# Altium schematic sheet PX1_Controle_ADC-LED.SchDoc
size 449 x 320 mm
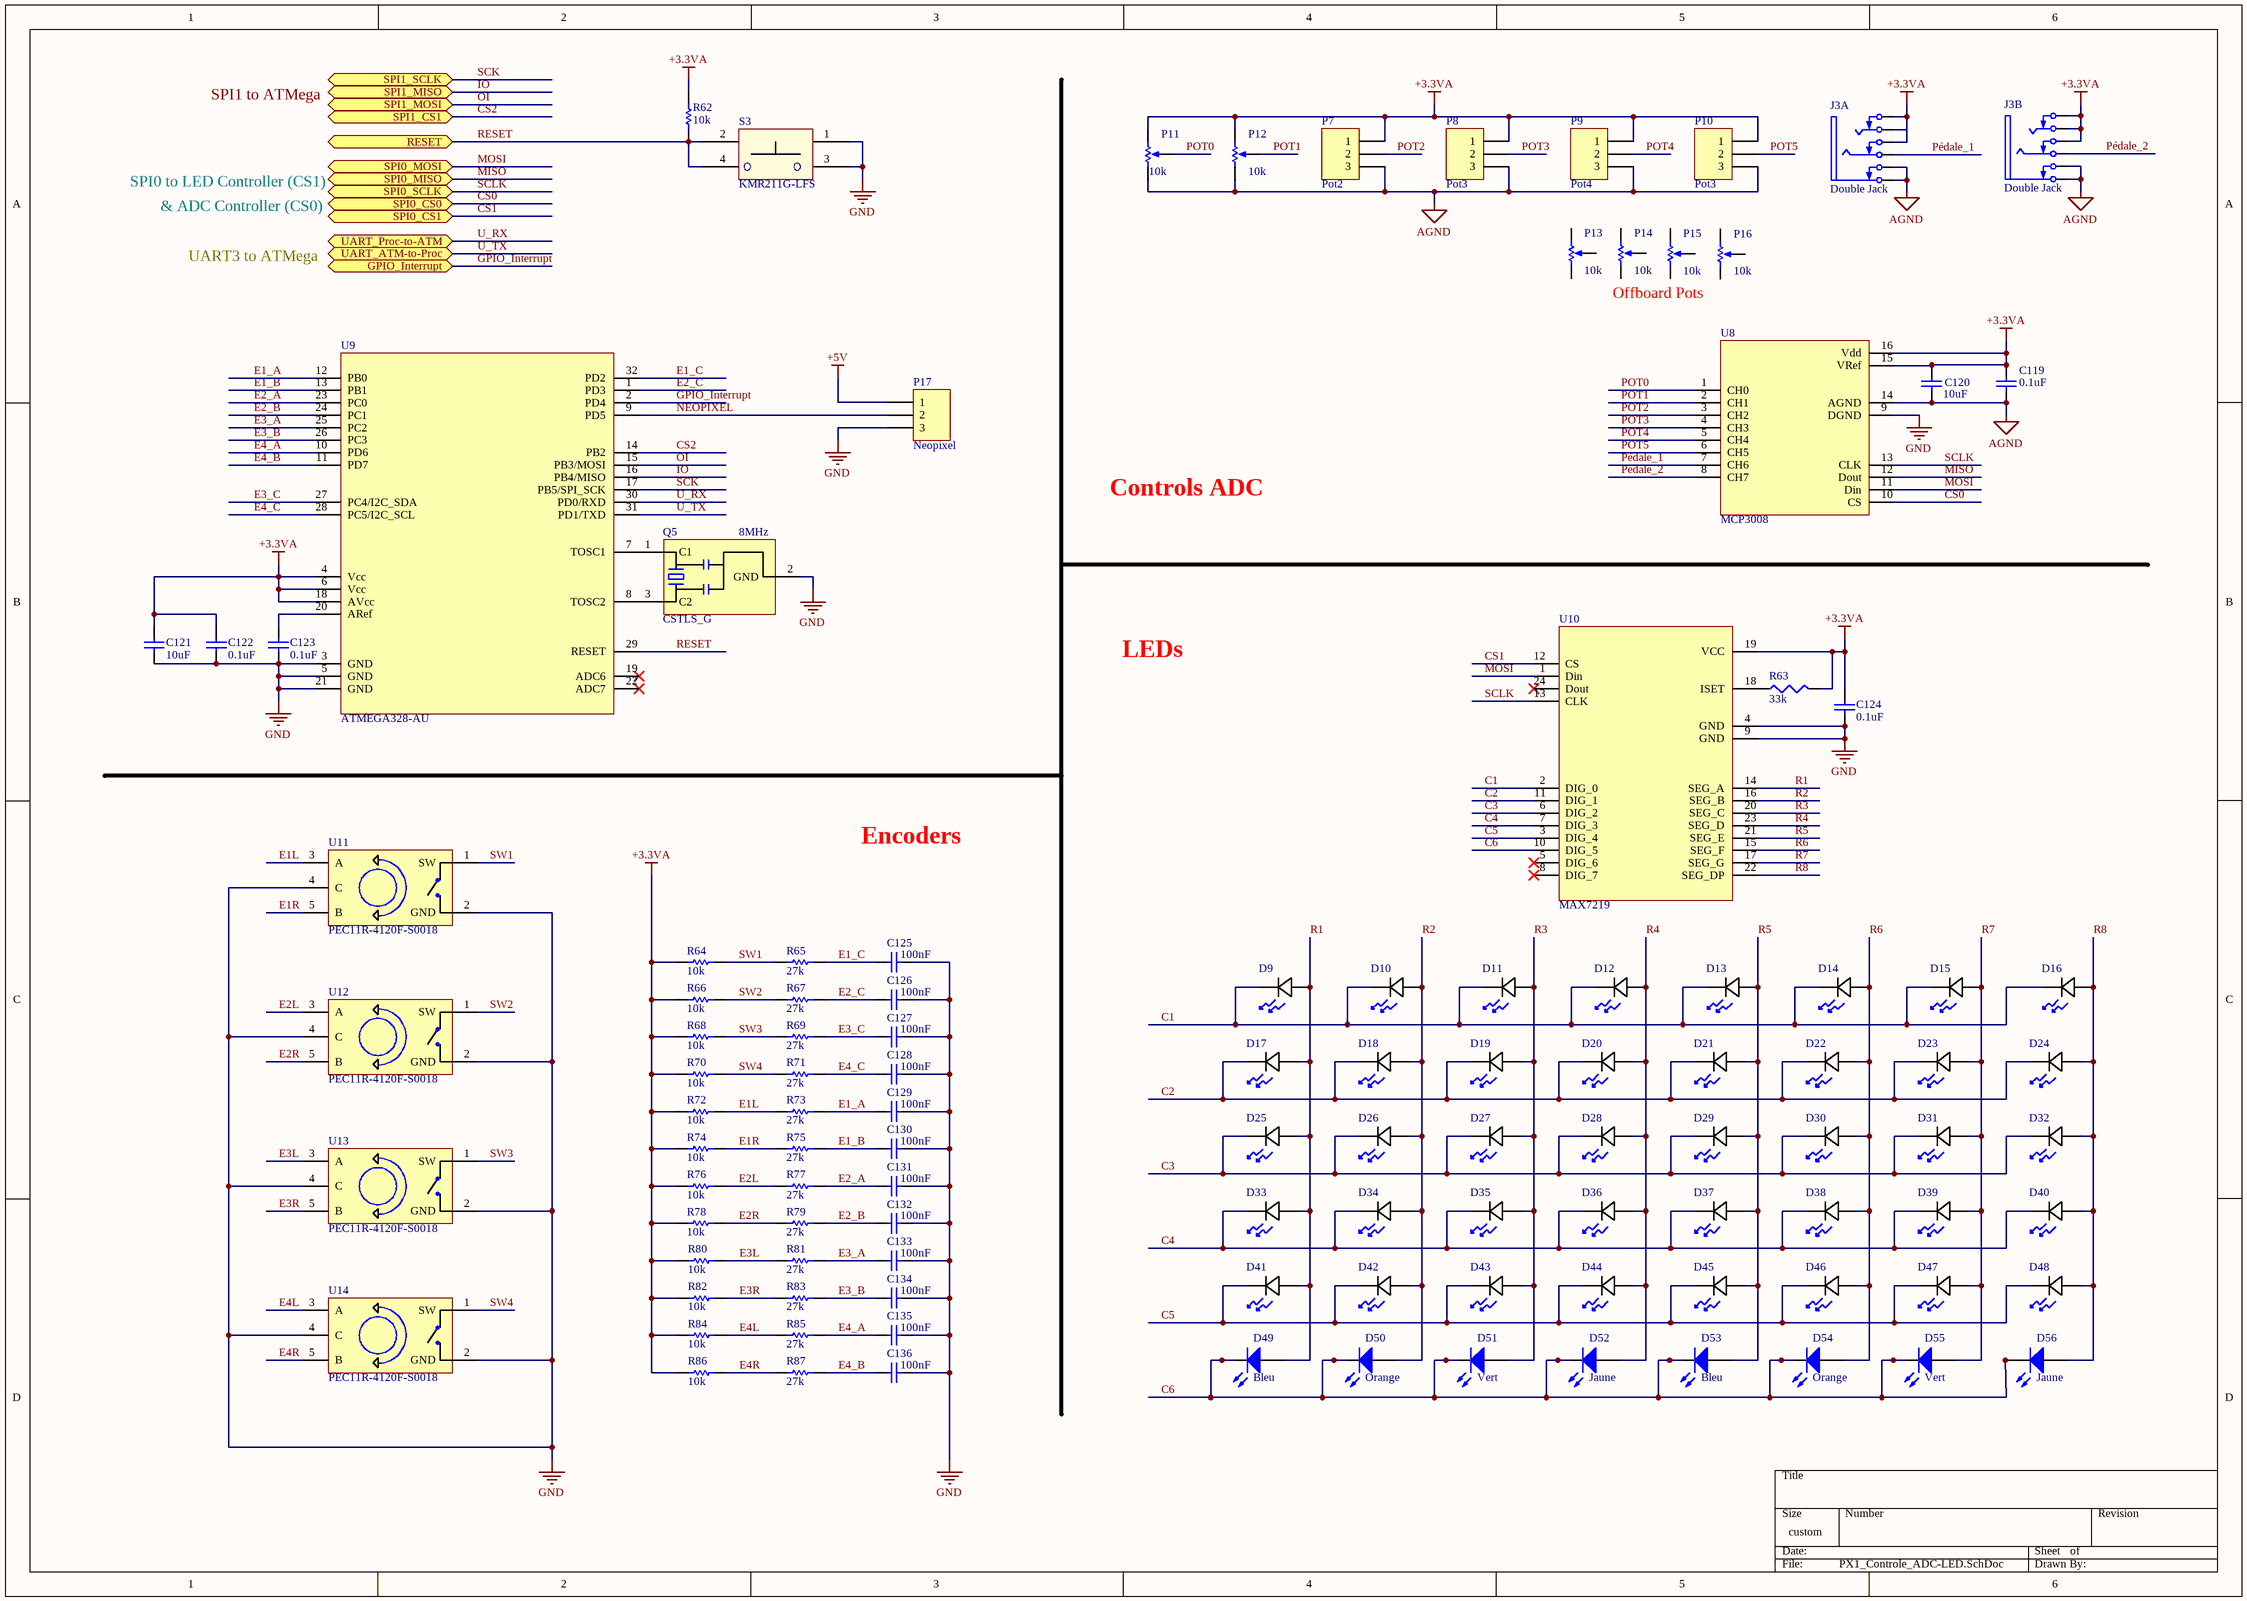
[diagram p0: PX1_Controle_ADC-LED.SchDoc]

## Parts
C119  0.1uF  [CAPC1608X08]
C120  10uF  [CAPC1608X08]
C121  value 10uF  [CAPC1608X08]  (hidden comment: Cap)
C122  value 0.1uF  [CAPC1608X08]  (hidden comment: Cap)
C123  value 0.1uF  [CAPC1608X08]  (hidden comment: Cap)
C124  value 0.1uF  [CAPC1608X08]  (hidden comment: Cap)
C125  value 100nF  [CAPC1608X08]  (hidden comment: Cap)
C126  value 100nF  [CAPC1608X08]  (hidden comment: Cap)
C127  value 100nF  [CAPC1608X08]  (hidden comment: Cap)
C128  value 100nF  [CAPC1608X08]  (hidden comment: Cap)
C129  value 100nF  [CAPC1608X08]  (hidden comment: Cap)
C130  value 100nF  [CAPC1608X08]  (hidden comment: Cap)
C131  value 100nF  [CAPC1608X08]  (hidden comment: Cap)
C132  value 100nF  [CAPC1608X08]  (hidden comment: Cap)
C133  value 100nF  [CAPC1608X08]  (hidden comment: Cap)
C134  value 100nF  [CAPC1608X08]  (hidden comment: Cap)
C135  value 100nF  [CAPC1608X08]  (hidden comment: Cap)
C136  value 100nF  [CAPC1608X08]  (hidden comment: Cap)
D9  LNJ937W8CRA  [LED_LNJ]  (value not drawn)
D10  LNJ937W8CRA  [LED_LNJ]  (value not drawn)
D11  LNJ937W8CRA  [LED_LNJ]  (value not drawn)
D12  LNJ937W8CRA  [LED_LNJ]  (value not drawn)
D13  LNJ937W8CRA  [LED_LNJ]  (value not drawn)
D14  LNJ937W8CRA  [LED_LNJ]  (value not drawn)
D15  LNJ937W8CRA  [LED_LNJ]  (value not drawn)
D16  LNJ937W8CRA  [LED_LNJ]  (value not drawn)
D17  LNJ937W8CRA  [LED_LNJ]  (value not drawn)
D18  LNJ937W8CRA  [LED_LNJ]  (value not drawn)
D19  LNJ937W8CRA  [LED_LNJ]  (value not drawn)
D20  LNJ937W8CRA  [LED_LNJ]  (value not drawn)
D21  LNJ937W8CRA  [LED_LNJ]  (value not drawn)
D22  LNJ937W8CRA  [LED_LNJ]  (value not drawn)
D23  LNJ937W8CRA  [LED_LNJ]  (value not drawn)
D24  LNJ937W8CRA  [LED_LNJ]  (value not drawn)
D25  LNJ937W8CRA  [LED_LNJ]  (value not drawn)
D26  LNJ937W8CRA  [LED_LNJ]  (value not drawn)
D27  LNJ937W8CRA  [LED_LNJ]  (value not drawn)
D28  LNJ937W8CRA  [LED_LNJ]  (value not drawn)
D29  LNJ937W8CRA  [LED_LNJ]  (value not drawn)
D30  LNJ937W8CRA  [LED_LNJ]  (value not drawn)
D31  LNJ937W8CRA  [LED_LNJ]  (value not drawn)
D32  LNJ937W8CRA  [LED_LNJ]  (value not drawn)
D33  LNJ937W8CRA  [LED_LNJ]  (value not drawn)
D34  LNJ937W8CRA  [LED_LNJ]  (value not drawn)
D35  LNJ937W8CRA  [LED_LNJ]  (value not drawn)
D36  LNJ937W8CRA  [LED_LNJ]  (value not drawn)
D37  LNJ937W8CRA  [LED_LNJ]  (value not drawn)
D38  LNJ937W8CRA  [LED_LNJ]  (value not drawn)
D39  LNJ937W8CRA  [LED_LNJ]  (value not drawn)
D40  LNJ937W8CRA  [LED_LNJ]  (value not drawn)
D41  LNJ937W8CRA  [LED_LNJ]  (value not drawn)
D42  LNJ937W8CRA  [LED_LNJ]  (value not drawn)
D43  LNJ937W8CRA  [LED_LNJ]  (value not drawn)
D44  LNJ937W8CRA  [LED_LNJ]  (value not drawn)
D45  LNJ937W8CRA  [LED_LNJ]  (value not drawn)
D46  LNJ937W8CRA  [LED_LNJ]  (value not drawn)
D47  LNJ937W8CRA  [LED_LNJ]  (value not drawn)
D48  LNJ937W8CRA  [LED_LNJ]  (value not drawn)
D49  Bleu  [LED_LNJ]
D50  Orange  [LED_LNJ]
D51  Vert  [LED_LNJ]
D52  Jaune  [LED_LNJ]
D53  Bleu  [LED_LNJ]
D54  Orange  [LED_LNJ]
D55  Vert  [LED_LNJ]
D56  Jaune  [LED_LNJ]
J3  Double Jack  [Amphenol_ACJS-MHDC]  (parts A,B of 2)
P7  Pot2  [CONN_1241150-3_T]
P8  Pot3  [CONN_1241150-3_T]
P9  Pot4  [CONN_1241150-3_T]
P10  Pot3  [CONN_1241150-3_T]
P11  value 10k  [ALPS_RK09K1130C79]  (hidden comment: RPot)
P12  value 10k  [ALPS_RK09K1130C79]  (hidden comment: RPot)
P13  value 10k  (hidden comment: RPot)
P14  value 10k  (hidden comment: RPot)
P15  value 10k  (hidden comment: RPot)
P16  value 10k  (hidden comment: RPot)
P17  Neopixel  [CONN_1241150-3_T]
Q5  CSTLS_G  value 8MHz  [CSTCC_G]
R62  value 10k  [RESC1608X05]  (hidden comment: Res1)
R63  33k  [RESC1608X05]
R64  value 10k  [RESC1608X05]  (hidden comment: Res1)
R65  value 27k  [RESC1608X05]  (hidden comment: Res1)
R66  value 10k  [RESC1608X05]  (hidden comment: Res1)
R67  value 27k  [RESC1608X05]  (hidden comment: Res1)
R68  value 10k  [RESC1608X05]  (hidden comment: Res1)
R69  value 27k  [RESC1608X05]  (hidden comment: Res1)
R70  value 10k  [RESC1608X05]  (hidden comment: Res1)
R71  value 27k  [RESC1608X05]  (hidden comment: Res1)
R72  value 10k  [RESC1608X05]  (hidden comment: Res1)
R73  value 27k  [RESC1608X05]  (hidden comment: Res1)
R74  value 10k  [RESC1608X05]  (hidden comment: Res1)
R75  value 27k  [RESC1608X05]  (hidden comment: Res1)
R76  value 10k  [RESC1608X05]  (hidden comment: Res1)
R77  value 27k  [RESC1608X05]  (hidden comment: Res1)
R78  value 10k  [RESC1608X05]  (hidden comment: Res1)
R79  value 27k  [RESC1608X05]  (hidden comment: Res1)
R80  value 10k  [RESC1608X05]  (hidden comment: Res1)
R81  value 27k  [RESC1608X05]  (hidden comment: Res1)
R82  value 10k  [RESC1608X05]  (hidden comment: Res1)
R83  value 27k  [RESC1608X05]  (hidden comment: Res1)
R84  value 10k  [RESC1608X05]  (hidden comment: Res1)
R85  value 27k  [RESC1608X05]  (hidden comment: Res1)
R86  value 10k  [RESC1608X05]  (hidden comment: Res1)
R87  value 27k  [RESC1608X05]  (hidden comment: Res1)
S3  KMR211G-LFS  [C&K_KMR211G]
U8  MCP3008  [SOIC16_MCP3008]
U9  ATMEGA328-AU  [32A-M]
U10  MAX7219  [21-0042B_24-M]
U11  PEC11R-4120F-S0018  [BOURNS_PEC11R-4120F-S0018]
U12  PEC11R-4120F-S0018  [BOURNS_PEC11R-4120F-S0018]
U13  PEC11R-4120F-S0018  [BOURNS_PEC11R-4120F-S0018]
U14  PEC11R-4120F-S0018  [BOURNS_PEC11R-4120F-S0018]

## Ports
GPIO_Interrupt, RESET, SPI0_CS0, SPI0_CS1, SPI0_MISO, SPI0_MOSI, SPI0_SCLK, SPI1_CS1, SPI1_MISO, SPI1_MOSI, SPI1_SCLK, UART_ATM-to-Proc, UART_Proc-to-ATM

## Nets
+3.3VA: C119.1 C120.1 C121.1 C122.1 C124.1 J3.2(RB) J3.3(TB) J3.6(T) J3.8(RB) J3.9(TB) J3.12(T) P7.1 P8.1 P9.1 P10.1 P11.2(BOT) P12.2(BOT) R62.1 R63.2 R64.1 R66.1 R68.1 R70.1 R72.1 R74.1 R76.1 R78.1 R80.1 R82.1 R84.1 R86.1 U8.15(VRef) U8.16(Vdd) U9.4(Vcc) U9.6(Vcc) U9.18(AVcc) U10.19(VCC)
+5V: P17.1
AGND: C119.2 C120.2 J3.1(SB) J3.4(S) J3.7(SB) J3.10(S) P7.3 P8.3 P9.3 P10.3 P11.1(TOP) P12.1(TOP) U8.14(AGND)
GND: C121.2 C122.2 C123.2 C124.2 C125.1 C126.1 C127.1 C128.1 C129.1 C130.1 C131.1 C132.1 C133.1 C134.1 C135.1 C136.1 P17.3 Q5.2(GND) S3.1 S3.3 U8.9(DGND) U9.3(GND) U9.5(GND) U9.21(GND) U10.4(GND) U10.9(GND) U11.2(GND) U11.4(C) U12.2(GND) U12.4(C) U13.2(GND) U13.4(C) U14.2(GND) U14.4(C)
C1: D9.1 D10.1 D11.1 D12.1 D13.1 D14.1 D15.1 D16.1 U10.2(DIG_0)
C2: D17.1 D18.1 D19.1 D20.1 D21.1 D22.1 D23.1 D24.1 U10.11(DIG_1)
C3: D25.1 D26.1 D27.1 D28.1 D29.1 D30.1 D31.1 D32.1 U10.6(DIG_2)
C4: D33.1 D34.1 D35.1 D36.1 D37.1 D38.1 D39.1 D40.1 U10.7(DIG_3)
C5: D41.1 D42.1 D43.1 D44.1 D45.1 D46.1 D47.1 D48.1 U10.3(DIG_4)
C6: D49.2(K) D50.2(K) D51.2(K) D52.2(K) D53.2(K) D54.2(K) D55.2(K) D56.2(K) U10.10(DIG_5)
CS0: U8.10(CS) ; port SPI0_CS0
CS1: U10.12(CS) ; port SPI0_CS1
CS2: U9.14(PB2) ; port SPI1_CS1
E1_A: C129.2 R73.2 U9.12(PB0)
E1_B: C130.2 R75.2 U9.13(PB1)
E1_C: C125.2 R65.2 U9.32(PD2)
E1L: R72.2 R73.1 U11.3(A)
E1R: R74.2 R75.1 U11.5(B)
E2_A: C131.2 R77.2 U9.23(PC0)
E2_B: C132.2 R79.2 U9.24(PC1)
E2_C: C126.2 R67.2 U9.1(PD3)
E2L: R76.2 R77.1 U12.3(A)
E2R: R78.2 R79.1 U12.5(B)
E3_A: C133.2 R81.2 U9.25(PC2)
E3_B: C134.2 R83.2 U9.26(PC3)
E3_C: C127.2 R69.2 U9.27(PC4/I2C_SDA)
E3L: R80.2 R81.1 U13.3(A)
E3R: R82.2 R83.1 U13.5(B)
E4_A: C135.2 R85.2 U9.10(PD6)
E4_B: C136.2 R87.2 U9.11(PD7)
E4_C: C128.2 R71.2 U9.28(PC5/I2C_SCL)
E4L: R84.2 R85.1 U14.3(A)
E4R: R86.2 R87.1 U14.5(B)
GPIO_Interrupt: U9.2(PD4) ; port GPIO_Interrupt
IO: U9.16(PB4/MISO) ; port SPI1_MISO
MISO: U8.12(Dout) ; port SPI0_MISO
MOSI: U8.11(Din) U10.1(Din) ; port SPI0_MOSI
NEOPIXEL: P17.2 U9.9(PD5)
OI: U9.15(PB3/MOSI) ; port SPI1_MOSI
POT0: P11.3(TAP) U8.1(CH0)
POT1: P12.3(TAP) U8.2(CH1)
POT2: P7.2 U8.3(CH2)
POT3: P8.2 U8.4(CH3)
POT4: P9.2 U8.5(CH4)
POT5: P10.2 U8.6(CH5)
Pédale_1: J3.11(R) U8.7(CH6)
Pédale_2: J3.5(R) U8.8(CH7)
R1: D9.2 D17.2 D25.2 D33.2 D41.2 D49.1(A) U10.14(SEG_A)
R2: D10.2 D18.2 D26.2 D34.2 D42.2 D50.1(A) U10.16(SEG_B)
R3: D11.2 D19.2 D27.2 D35.2 D43.2 D51.1(A) U10.20(SEG_C)
R4: D12.2 D20.2 D28.2 D36.2 D44.2 D52.1(A) U10.23(SEG_D)
R5: D13.2 D21.2 D29.2 D37.2 D45.2 D53.1(A) U10.21(SEG_E)
R6: D14.2 D22.2 D30.2 D38.2 D46.2 D54.1(A) U10.15(SEG_F)
R7: D15.2 D23.2 D31.2 D39.2 D47.2 D55.1(A) U10.17(SEG_G)
R8: D16.2 D24.2 D32.2 D40.2 D48.2 D56.1(A) U10.22(SEG_DP)
RESET: R62.2 S3.2 S3.4 U9.29(RESET) ; port RESET
SCK: U9.17(PB5/SPI_SCK) ; port SPI1_SCLK
SCLK: U8.13(CLK) U10.13(CLK) ; port SPI0_SCLK
SW1: R64.2 R65.1 U11.1(SW)
SW2: R66.2 R67.1 U12.1(SW)
SW3: R68.2 R69.1 U13.1(SW)
SW4: R70.2 R71.1 U14.1(SW)
U_RX: U9.30(PD0/RXD) ; port UART_Proc-to-ATM
U_TX: U9.31(PD1/TXD) ; port UART_ATM-to-Proc
NetC123_1: C123.1 U9.20(ARef)
NetQ5_1: Q5.1(C1) U9.7(TOSC1)
NetQ5_3: Q5.3(C2) U9.8(TOSC2)
NetR63_1: R63.1 U10.18(ISET)

Not connected (* = marked no-connect by the designer): P13 1(TOP) 2(BOT) 3(TAP); P14 1(TOP) 2(BOT) 3(TAP); P15 1(TOP) 2(BOT) 3(TAP); P16 1(TOP) 2(BOT) 3(TAP); U9 19(ADC6)* 22(ADC7)*; U10 5(DIG_6)* 8(DIG_7)* 24(Dout)*

## Notes on the sheet
- SPI1 to ATMega
- & ADC Controller (CS0)
- SPI0 to LED Controller (CS1)
- UART3 to ATMega
- Offboard Pots
- Controls ADC
- LEDs
- Encoders

## Library data of the parts
C119 = Cap Semi: Capacitor (Semiconductor SIM Model); Fabricant: MURATA; Fournisseur: Farnell; RefFabricant: GRM188F51E104ZA01D; RefFournisseur: 2821272; Value: 0.1uF; Case: 0603 [1608 Metric]; DataSheet: http://www.farnell.com/datasheets/2048672.pdf
C120 = Cap Semi: Capacitor (Semiconductor SIM Model); Fabricant: MURATA; Fournisseur: Farnell; RefFabricant: GRM188R60J106ME47J; RefFournisseur: 2611921; Value: 10uF; Case: 0603 [1608 Metric]; DataSheet: http://www.farnell.com/datasheets/2079165.pdf
C121 = Cap: Capacitor; Fabricant: MURATA; Fournisseur: Farnell; RefFabricant: GRM188R60J106ME47J; RefFournisseur: 2611921; Case: 0603 [1608 Metric]; DataSheet: http://www.farnell.com/datasheets/2079165.pdf
C122-C124 = Cap: Capacitor; Fabricant: MURATA; Fournisseur: Farnell; RefFabricant: GRM188F51E104ZA01D; RefFournisseur: 2821272; Case: 0603 [1608 Metric]; DataSheet: http://www.farnell.com/datasheets/2048672.pdf
C125-C136 = Cap: Capacitor; Fabricant: MURATA; Fournisseur: Farnell; RefFabricant: GRM188F51E104ZA01D; RefFournisseur: 1828902; Case: 0603 [1608 Metric]; DataSheet: http://www.farnell.com/datasheets/2048672.pdf
D9-D48 = LNJ937W8CRA: LED Bleu; Fabricant: PANASONIC ELECTRONIC COMPONENTS; Fournisseur: Farnell; RefFournisseur: 1908058; RefFabricant: LNJ937W8CRA; DataSheet: http://www.farnell.com/datasheets/1915212.pdf
D49 D53 = LED0: Typical INFRARED GaAs LED; RefFabricant: KPT-1608QBC-D; Fabricant: KINGBRIGHT; Fournisseur: Farnell; RefFournisseur: 2217978; DataSheet: http://www.farnell.com/datasheets/2085723.pdf
D50 D54 = LED0: Typical INFRARED GaAs LED; RefFabricant: KP-2012SECK; Fabricant: KINGBRIGHT; Fournisseur: Farnell; RefFournisseur: 2290332; DataSheet: http://www.farnell.com/datasheets/2085723.pdf
D51 D55 = LED0: Typical INFRARED GaAs LED; RefFabricant: KPH-1608SGC; Fabricant: KINGBRIGHT; Fournisseur: Farnell; RefFournisseur: 2426215; DataSheet: http://www.farnell.com/datasheets/2085723.pdf
D52 D56 = LED0: Typical INFRARED GaAs LED; RefFabricant: KPT-2012YC; Fabricant: KINGBRIGHT; Fournisseur: Farnell; RefFournisseur: 2099243; DataSheet: http://www.farnell.com/datasheets/2085723.pdf
J3 = Dual TRS Jack Bypassed: Dual Jack stereo bypassed; Fabricant: AMPHENOL; Fournisseur: Farnell; RefFabricant: ACJS-MHDC; RefFournisseur: 2771861; DataSheet: http://www.farnell.com/datasheets/866888.pdf
P7-P10 P17 = Header 3: Header, 3-Pin; Fabricant: AMP - TE CONNECTIVITY; Fournisseur: Farnell; RefFabricant: 1241150-3; RefFournisseur: 9689478; DataSheet: http://www.farnell.com/datasheets/318453.pdf
P11 P12 = RPot: Potentiometer; Fabricant: ALPS; Fournisseur: Farnell; RefFabricant: RK09K1130C79; RefFournisseur: 1191741; DataSheet: http://www.farnell.com/datasheets/2160634.pdf; Case: Through-Hole_5
P13-P16 = RPot: Potentiometer; Fabricant: Bi Technology; Fournisseur: Farnell; RefFabricant: P160KMP-0QC20B10K; RefFournisseur: 1760793; DataSheet: http://www.farnell.com/datasheets/2331843.pdf
Q5 = CSTLS_G: Ceramic Resonator; RefFabricant: CSTCC8M00G53-R0; Fabricant: MURATA; Fournisseur: Farnell; RefFournisseur: 1170435; DataSheet: http://www.farnell.com/datasheets/19296.pdf
R62 R64 R66 R68 R70 R72 R74 R76 R78 R80 R82 R84 R86 = Res1: Resistor; Fabricant: TE CONNECTIVITY; Fournisseur: Farnell; RefFabricant: CPF-A-0603B4K7E1; RefFournisseur: 2483933; Case: 0603 [1608 Metric]; DataSheet: http://www.farnell.com/datasheets/1935020.pdf
R63 = Res3: Resistor; Fabricant: TE CONNECTIVITY; Fournisseur: Farnell; RefFabricant: CPF-A-0603B33KE1; RefFournisseur: 2483920; Value: 33k; Case: 0603 [1608 Metric]
R65 R67 R69 R71 R73 R75 R77 R79 R81 R83 R85 R87 = Res1: Resistor; Fabricant: TE CONNECTIVITY; Fournisseur: Farnell; RefFabricant: CRGH0603F27K; RefFournisseur: 2332021; Case: 0603 [1608 Metric]; DataSheet: http://www.farnell.com/datasheets/1755795.pdf
S3 = KMR211G-LFS: Commutateur tactile; Fournisseur: Farnell; RefFournisseur: 1437635; RefFabricant: KMR211G LFS; Fabricant: C & K COMPONENTS; DataSheet: http://www.farnell.com/datasheets/2044619.pdf
U8 = MCP3008: 8 ADC Package SPI; RefFournisseur: 1292241; RefFabricant: MCP3008-I/SL; Fabricant: MICROCHIP; Fournisseur: Farnell; DataSheet: http://www.farnell.com/datasheets/808965.pdf
U9 = ATMEGA328-AU: Micro-contrôleur ATMEGA; Fournisseur: Farnell; RefFournisseur: 1972086; Fabricant: MicroChip; RefFabricant: ATMEGA328-AU; DataSheet: http://www.farnell.com/datasheets/2047852.pdf
U10 = MAX7219: LED_Controller; RefFabricant: MAX7219CWG+; Fabricant: MAXIM; RefFournisseur: 2519520; Fournisseur: Farnell; DataSheet: http://www.farnell.com/datasheets/1825883.pdf
U11-U14 = PEC11R-4120F-S0018: Encodeurs cliquables; RefFournisseur: 2663521; Fournisseur: Farnell; Fabricant: BOURNS; RefFabricant: PEC11R-4120F-S0018; DataSheet: http://www.farnell.com/datasheets/2360546.pdf; Case: Through-Hole_7